# Altium schematic sheet Cortex_Power.SchDoc: LPC4337 - Power
size A4; Author: Andreas Rehn; CompanyName: Hochschule Ulm; DrawnBy: Andreas Rehn; Engineer: Andreas Rehn; Organization: Hochschule Ulm; Address1: Institut für Medizintechnik; Address2: und Mechatronik; Address3: Albert-Einstein-Allee 55; Address4: 89081 Ulm; SheetNumber: 8; SheetTotal: 11
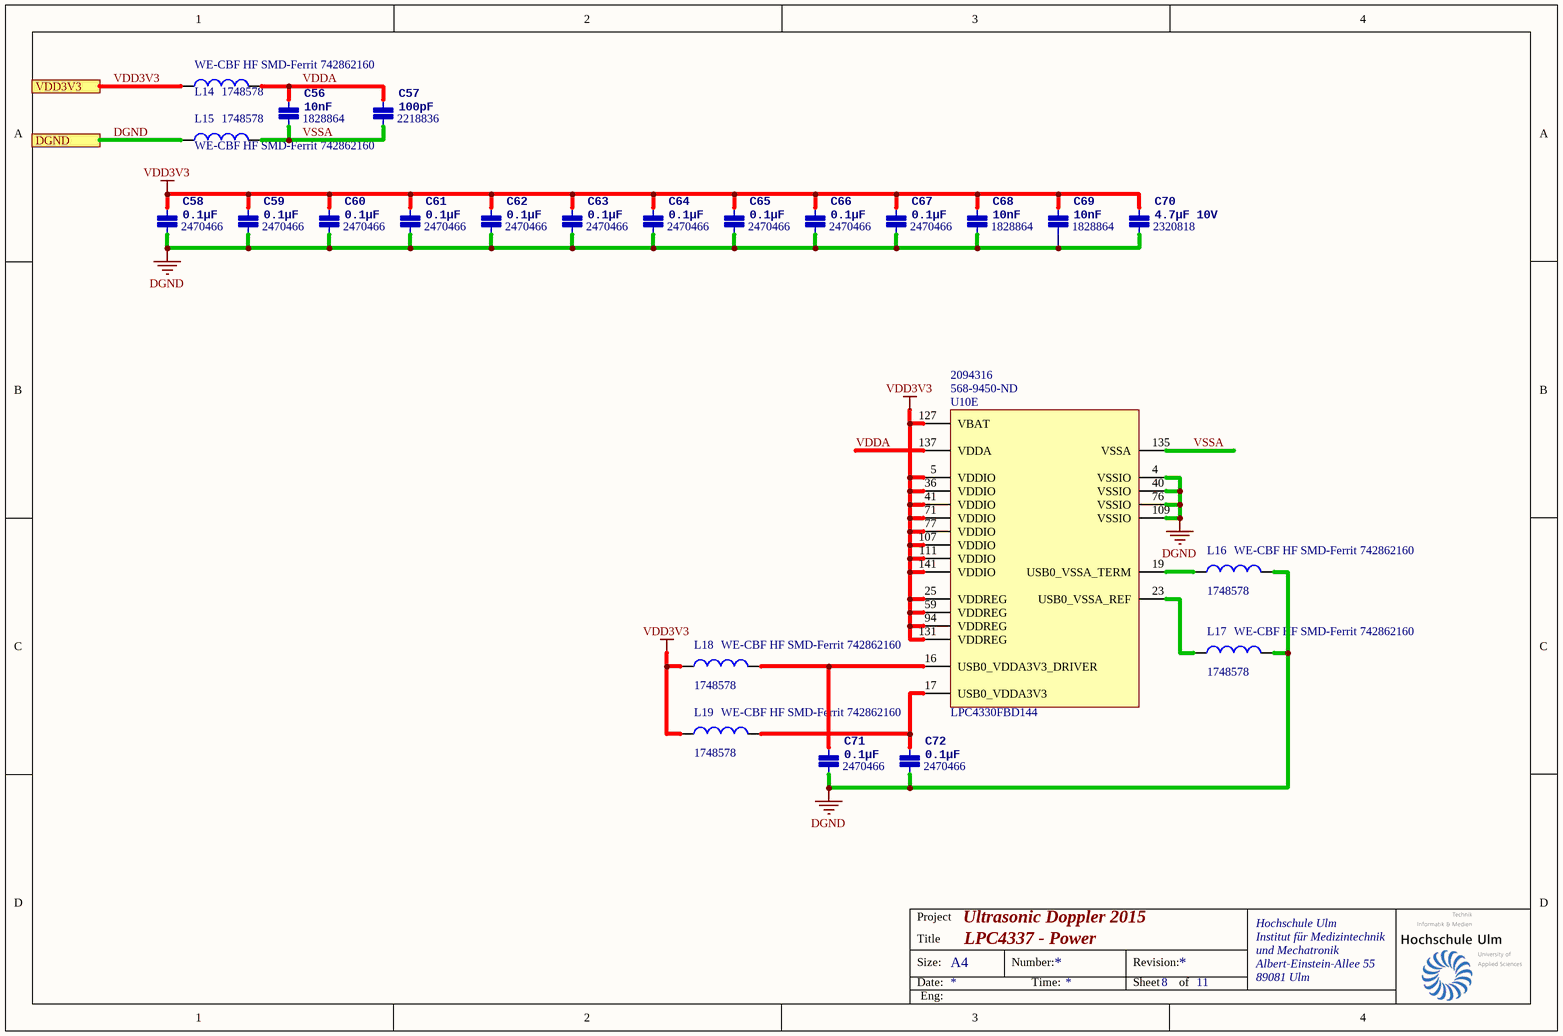
[diagram p0: Cortex_Power.SchDoc]

## Parts
C56  10nF  Supplier Part Number 1: 1828864  [0402[1005]]
C57  100pF  Supplier Part Number 1: 2218836  [0402[1005]]
C58  0.1µF  Supplier Part Number 1: 2470466  [0402[1005]]
C59  0.1µF  Supplier Part Number 1: 2470466  [0402[1005]]
C60  0.1µF  Supplier Part Number 1: 2470466  [0402[1005]]
C61  0.1µF  Supplier Part Number 1: 2470466  [0402[1005]]
C62  0.1µF  Supplier Part Number 1: 2470466  [0402[1005]]
C63  0.1µF  Supplier Part Number 1: 2470466  [0402[1005]]
C64  0.1µF  Supplier Part Number 1: 2470466  [0402[1005]]
C65  0.1µF  Supplier Part Number 1: 2470466  [0402[1005]]
C66  0.1µF  Supplier Part Number 1: 2470466  [0402[1005]]
C67  0.1µF  Supplier Part Number 1: 2470466  [0402[1005]]
C68  10nF  Supplier Part Number 1: 1828864  [0402[1005]]
C69  10nF  Supplier Part Number 1: 1828864  [0402[1005]]
C70  4.7µF 10V  Supplier Part Number 1: 2320818  [0603[1508]]
C71  0.1µF  Supplier Part Number 1: 2470466  [0402[1005]]
C72  0.1µF  Supplier Part Number 1: 2470466  [0402[1005]]
L14  WE-CBF HF SMD-Ferrit 742862160  Supplier Part Number 1: 1748578  [0603[1508]]
L15  WE-CBF HF SMD-Ferrit 742862160  Supplier Part Number 1: 1748578  [0603[1508]]
L16  WE-CBF HF SMD-Ferrit 742862160  Supplier Part Number 1: 1748578  [0603[1508]]
L17  WE-CBF HF SMD-Ferrit 742862160  Supplier Part Number 1: 1748578  [0603[1508]]
L18  WE-CBF HF SMD-Ferrit 742862160  Supplier Part Number 1: 1748578  [0603[1508]]
L19  WE-CBF HF SMD-Ferrit 742862160  Supplier Part Number 1: 1748578  [0603[1508]]
U10  LPC4330FBD144  Supplier Part Number 1: 568-9450-ND  Supplier Part Number 2: 2094316  [LQFP144]  (part E of 5)

## Ports
DGND, VDD3V3

## Nets
DGND: C58.2(P$2) C59.2(P$2) C60.2(P$2) C61.2(P$2) C62.2(P$2) C63.2(P$2) C64.2(P$2) C65.2(P$2) C66.2(P$2) C67.2(P$2) C68.2(P$2) C69.2(P$2) C70.2(P$2) C71.2(P$2) C72.2(P$2) L15.1 L16.2 L17.2 U10.4(VSSIO) U10.40(VSSIO) U10.76(VSSIO) U10.109(VSSIO) ; port DGND
VDD3V3: C58.1(P$1) C59.1(P$1) C60.1(P$1) C61.1(P$1) C62.1(P$1) C63.1(P$1) C64.1(P$1) C65.1(P$1) C66.1(P$1) C67.1(P$1) C68.1(P$1) C69.1(P$1) C70.1(P$1) L14.1 L18.1 L19.1 U10.5(VDDIO) U10.25(VDDREG) U10.36(VDDIO) U10.41(VDDIO) U10.59(VDDREG) U10.71(VDDIO) U10.77(VDDIO) U10.94(VDDREG) U10.107(VDDIO) U10.111(VDDIO) U10.127(VBAT) U10.131(VDDREG) U10.141(VDDIO) ; port VDD3V3
VDDA: C56.1(P$1) C57.1(P$1) L14.2 U10.137(VDDA)
VSSA: C56.2(P$2) C57.2(P$2) L15.2 U10.135(VSSA)
NetC71_1: C71.1(P$1) L18.2 U10.16(USB0_VDDA3V3_DRIVER)
NetC72_1: C72.1(P$1) L19.2 U10.17(USB0_VDDA3V3)
NetL16_1: L16.1 U10.19(USB0_VSSA_TERM)
NetL17_1: L17.1 U10.23(USB0_VSSA_REF)

## Notes on the sheet
- Project
- Ultrasonic Doppler 2015
- Title
- Size:
- Date:
- A4
- Number:
- Time:
- Revision:
- Sheet
- of
- Eng:

## Library data of the parts
C56-C72 = Capacitor: Cap; Supplier 1: Farnell
  C56 C68 C69: value: 10nF
  C57: value: 100pF
  C58-C67 C71 C72: value: 0.1µF
  C70: value: 4.7µF 10V
L14-L19 = Inductor: Ferrit; Code_IEC: 1005; Published: 8-Jun-2000; LatestRevisionDate: 29-May-2009; LatestRevisionNote: IPC-7351 Footprint Added.; PackageReference: 0402-A; Publisher: Altium Limited; PackageDescription: Chip Inductor; Code_JEITA: 0402; Value: WE-CBF HF SMD-Ferrit 742862160; Supplier 1: Farnell
U10 = LPC4330FBD144: 32-bit ARM Cortex-M4 MCU, 264 kB SRAM, 2 HS USB with on-chip PHY, Ethernet, CAN, AES, SPIFI, SGPIO, SCT, 144-Pin LQFP; fmax: 204 MHz; GPIOs: 83; SRAM: 264 kB; ROM: 64 kB; Ethernet: Y; USB: 2; ADC channels: 8; SPI: 1; UART: 4; VDD (min): 2.2 V; VDD (max): 3.6 V; Code_IEC: 136E23; DatasheetVersion: Rev.3.1, Jan-2012; PackageVersion: Feb-2003; PackageReference: SOT486-1; PackageDescription: LQFP144: Plastic Low Profile Quad Flat Package; 144 Leads; Body 20 x 20 x 1.4 mm; PWM: Y; PLL: Y; I2C: 2; CAN: 2; Timers: 4; Code_JEDEC: MS-026; ComponentLink1Description: Manufacturer URL; ComponentLink1URL: http://www.nxp.com/; ComponentLink2Description: Datasheet; ComponentLink2URL: http://www.nxp.com/documents/data_sheet/LPC4350_30_20_10.pdf; Supplier 1: Digi-Key; Supplier 2: Farnell